# Altium schematic sheet REVISION HISTORY.SchDoc
size A3; DocumentNumber: 4; SheetNumber: 7; SheetTotal: 7
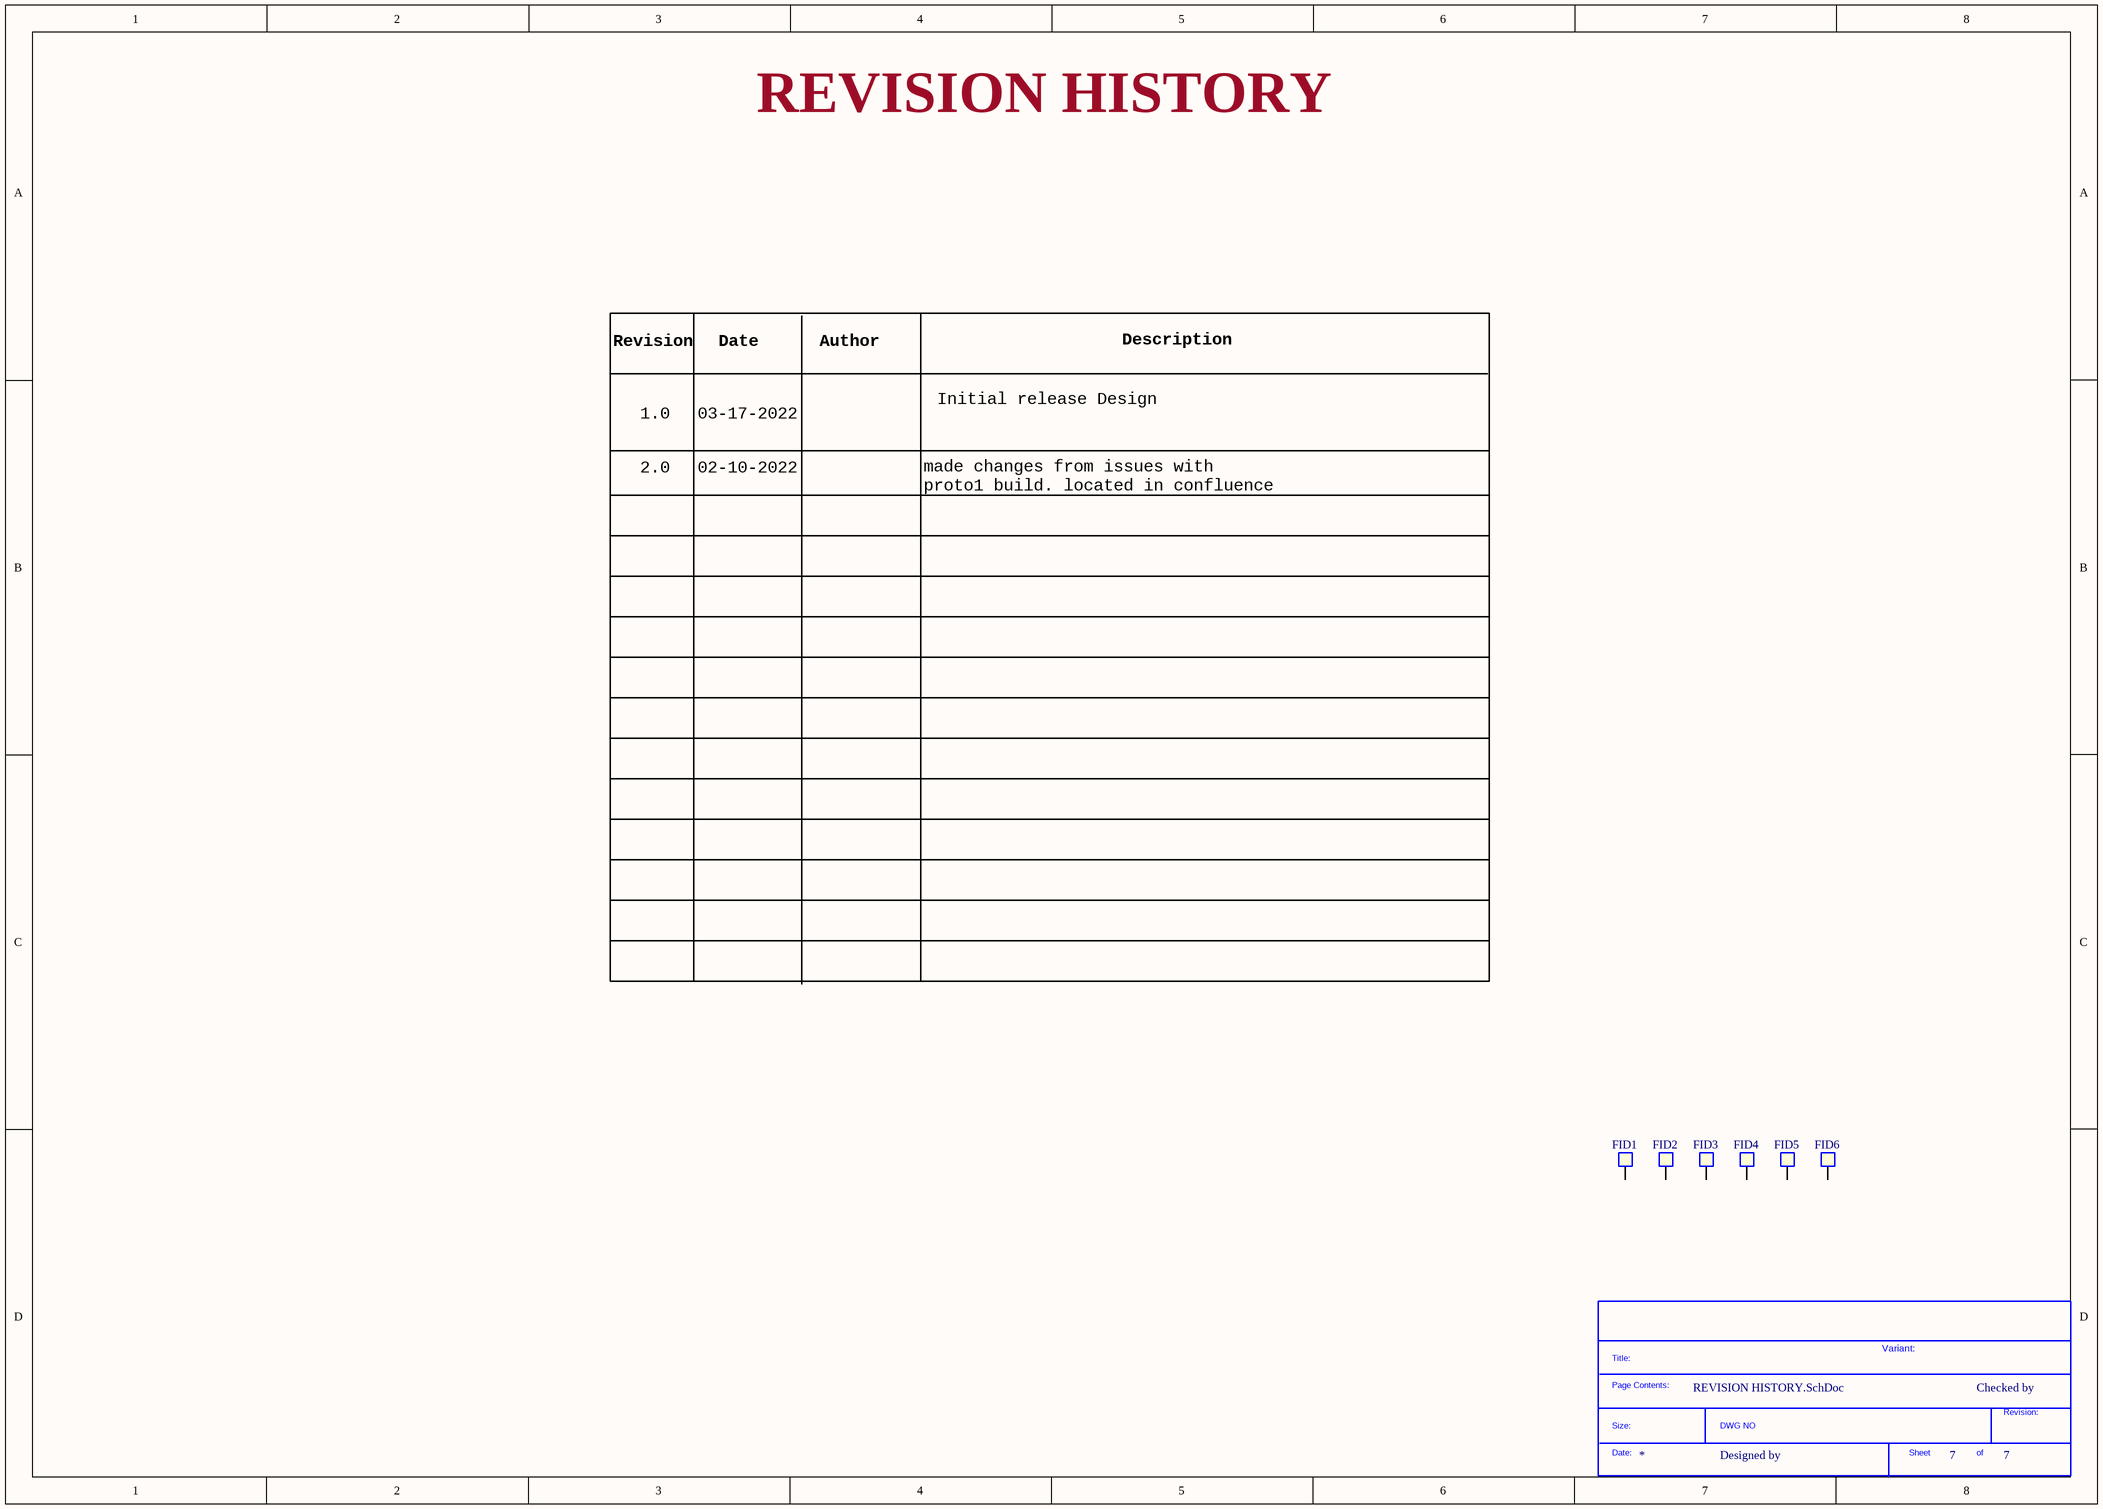
[diagram p0: REVISION HISTORY.SchDoc]

## Parts
*?  SDTitleBlock  (value not drawn)  (graphical)
FID1  TPS  [FIDUCIAL]  (value not drawn)  (no BOM)
FID2  TPS  [FIDUCIAL]  (value not drawn)  (no BOM)
FID3  TPS  [FIDUCIAL]  (value not drawn)  (no BOM)
FID4  TPS  [FIDUCIAL]  (value not drawn)  (no BOM)
FID5  TPS  [FIDUCIAL]  (value not drawn)  (no BOM)
FID6  TPS  [FIDUCIAL]  (value not drawn)  (no BOM)

## Nets

Not connected (* = marked no-connect by the designer): FID1 1(TP); FID2 1(TP); FID3 1(TP); FID4 1(TP); FID5 1(TP); FID6 1(TP)

## Notes on the sheet
- REVISION HISTORY
- Revision
- Date
- Author
- Description
- 1.0
- 03-17-2022
- Initial release Design
- 2.0
- 02-10-2022
- made changes from issues with proto1 build. located in confluence
- Variant:
- Checked by
- Designed by
- (in symbol SDTitleBlock) Title:; Page Contents:; Revision:; Size:; DWG NO; Date:; Sheet; of

## Library data of the parts
FID1-FID6 = FIDUCIAL: Pkg Type: SMD; Distributor: FAE; PCB Footprint: FIDUCIAL